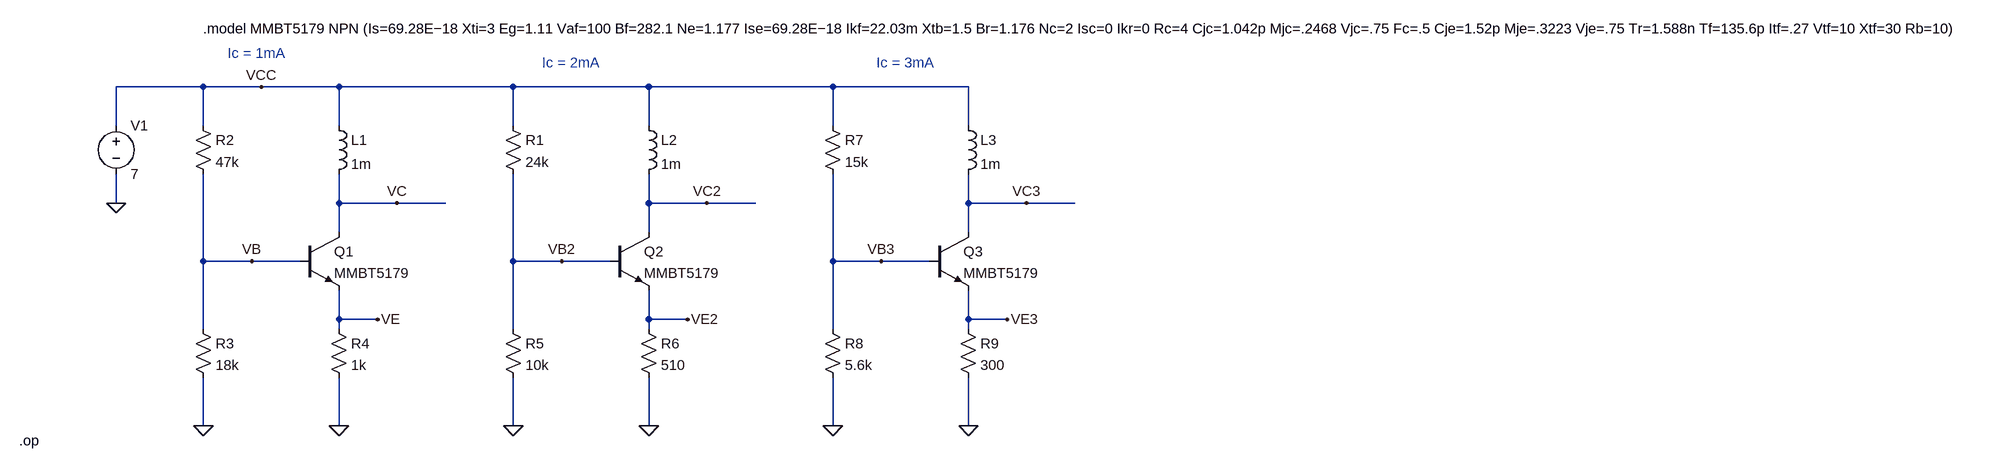
[diagram p0: schematic 1_DC-bias.asc]
1_DC-bias.asc, the LTspice schematic file:
Version 4
SHEET 1 3044 680
WIRE -208 -304 -352 -304
WIRE -112 -304 -208 -304
WIRE 16 -304 -112 -304
WIRE 304 -304 16 -304
WIRE 528 -304 304 -304
WIRE 832 -304 528 -304
WIRE 1056 -304 832 -304
WIRE -352 -240 -352 -304
WIRE -208 -240 -208 -304
WIRE 16 -240 16 -304
WIRE 304 -240 304 -304
WIRE 528 -240 528 -304
WIRE 832 -240 832 -304
WIRE 1056 -240 1056 -304
WIRE -352 -112 -352 -160
WIRE 16 -112 16 -160
WIRE 112 -112 16 -112
WIRE 192 -112 112 -112
WIRE 528 -112 528 -160
WIRE 624 -112 528 -112
WIRE 704 -112 624 -112
WIRE 1056 -112 1056 -160
WIRE 1152 -112 1056 -112
WIRE 1232 -112 1152 -112
WIRE 16 -64 16 -112
WIRE 528 -64 528 -112
WIRE 1056 -64 1056 -112
WIRE -208 -16 -208 -160
WIRE -128 -16 -208 -16
WIRE -48 -16 -128 -16
WIRE 304 -16 304 -160
WIRE 384 -16 304 -16
WIRE 464 -16 384 -16
WIRE 832 -16 832 -160
WIRE 912 -16 832 -16
WIRE 992 -16 912 -16
WIRE 16 80 16 32
WIRE 80 80 16 80
WIRE 528 80 528 32
WIRE 592 80 528 80
WIRE 1056 80 1056 32
WIRE 1120 80 1056 80
WIRE -208 96 -208 -16
WIRE 16 96 16 80
WIRE 304 96 304 -16
WIRE 528 96 528 80
WIRE 832 96 832 -16
WIRE 1056 96 1056 80
WIRE -208 256 -208 176
WIRE 16 256 16 176
WIRE 304 256 304 176
WIRE 528 256 528 176
WIRE 832 256 832 176
WIRE 1056 256 1056 176
FLAG -352 -112 0
FLAG -208 256 0
FLAG 16 256 0
FLAG 80 80 VE
FLAG -128 -16 VB
FLAG 112 -112 VC
FLAG -112 -304 VCC
FLAG 304 256 0
FLAG 528 256 0
FLAG 592 80 VE2
FLAG 384 -16 VB2
FLAG 624 -112 VC2
FLAG 832 256 0
FLAG 1056 256 0
FLAG 1120 80 VE3
FLAG 912 -16 VB3
FLAG 1152 -112 VC3
SYMBOL res -224 -256 R0
SYMATTR InstName R2
SYMATTR Value 47k
SYMBOL res -224 80 R0
SYMATTR InstName R3
SYMATTR Value 18k
SYMBOL res 0 80 R0
SYMATTR InstName R4
SYMATTR Value 1k
SYMBOL voltage -352 -256 R0
WINDOW 123 0 0 Left 0
WINDOW 39 0 0 Left 0
SYMATTR InstName V1
SYMATTR Value 7
SYMBOL npn -48 -64 R0
SYMATTR InstName Q1
SYMATTR Value MMBT5179
SYMBOL ind 0 -256 R0
SYMATTR InstName L1
SYMATTR Value 1m
SYMBOL res 288 -256 R0
SYMATTR InstName R1
SYMATTR Value 24k
SYMBOL res 288 80 R0
SYMATTR InstName R5
SYMATTR Value 10k
SYMBOL res 512 80 R0
SYMATTR InstName R6
SYMATTR Value 510
SYMBOL npn 464 -64 R0
SYMATTR InstName Q2
SYMATTR Value MMBT5179
SYMBOL ind 512 -256 R0
SYMATTR InstName L2
SYMATTR Value 1m
SYMBOL res 816 -256 R0
SYMATTR InstName R7
SYMATTR Value 15k
SYMBOL res 816 80 R0
SYMATTR InstName R8
SYMATTR Value 5.6k
SYMBOL res 1040 80 R0
SYMATTR InstName R9
SYMATTR Value 300
SYMBOL npn 992 -64 R0
SYMATTR InstName Q3
SYMATTR Value MMBT5179
SYMBOL ind 1040 -256 R0
SYMATTR InstName L3
SYMATTR Value 1m
TEXT -512 280 Left 2 !.op
TEXT -208 -400 Left 2 !.model MMBT5179 NPN (Is=69.28E−18 Xti=3 Eg=1.11 Vaf=100 Bf=282.1 Ne=1.177 Ise=69.28E−18 Ikf=22.03m Xtb=1.5 Br=1.176 Nc=2 Isc=0 Ikr=0 Rc=4 Cjc=1.042p Mjc=.2468 Vjc=.75 Fc=.5 Cje=1.52p Mje=.3223 Vje=.75 Tr=1.588n Tf=135.6p Itf=.27 Vtf=10 Xtf=30 Rb=10)
TEXT -168 -360 Left 2 ;Ic = 1mA
TEXT 352 -344 Left 2 ;Ic = 2mA
TEXT 904 -344 Left 2 ;Ic = 3mA

The netlist it stands for:
* 1_DC-bias.asc
R2 VCC VB 47k
R3 VB 0 18k
R4 VE 0 1k
V1 VCC 0 7
Q1 VC VB VE 0 MMBT5179
L1 VCC VC 1m
R1 VCC VB2 24k
R5 VB2 0 10k
R6 VE2 0 510
Q2 VC2 VB2 VE2 0 MMBT5179
L2 VCC VC2 1m
R7 VCC VB3 15k
R8 VB3 0 5.6k
R9 VE3 0 300
Q3 VC3 VB3 VE3 0 MMBT5179
L3 VCC VC3 1m
.model NPN NPN
.model PNP PNP
.lib standard.bjt
.op
.model MMBT5179 NPN (Is=69.28E−18 Xti=3 Eg=1.11 Vaf=100 Bf=282.1 Ne=1.177 Ise=69.28E−18 Ikf=22.03m Xtb=1.5 Br=1.176 Nc=2 Isc=0 Ikr=0 Rc=4 Cjc=1.042p Mjc=.2468 Vjc=.75 Fc=.5 Cje=1.52p Mje=.3223 Vje=.75 Tr=1.588n Tf=135.6p Itf=.27 Vtf=10 Xtf=30 Rb=10)
* Ic = 1mA
* Ic = 2mA
* Ic = 3mA
.backanno
.end